# Altium project tyre_temps.PrjPcb
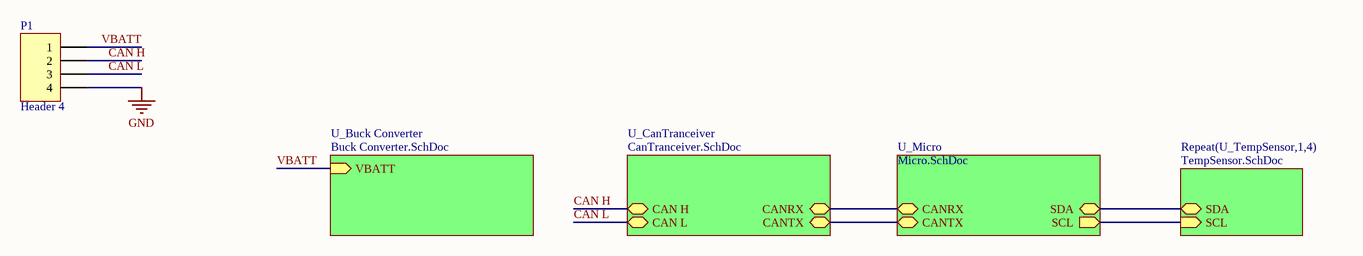
[diagram p0: Top Level.SchDoc]
5 sheets, 21 parts. Net scope: hierarchical (ports join the sheet entries above them; power ports are global).
Board file: tyre_temps.PcbDoc
Sheets:
  Top Level.SchDoc
    U_TempSensor1 = TempSensor.SchDoc
    U_TempSensor2 = TempSensor.SchDoc
    U_TempSensor3 = TempSensor.SchDoc
    U_TempSensor4 = TempSensor.SchDoc
    U_Buck Converter = Buck Converter.SchDoc
    U_CanTranceiver = CanTranceiver.SchDoc
    U_Micro = Micro.SchDoc

## Sheet Top Level.SchDoc
size A4

### Parts
P1  Header 4  [HDR1X4]

### Sub-sheets
Repeat(U_TempSensor,1,4) = TempSensor.SchDoc: SDA (bidir), SCL (in)
U_Buck Converter = Buck Converter.SchDoc: VBATT (in)
U_CanTranceiver = CanTranceiver.SchDoc: CANTX (bidir), CANRX (bidir), CAN H (bidir), CAN L (bidir)
U_Micro = Micro.SchDoc: SDA (bidir), SCL (out), CANRX (bidir), CANTX (bidir)

### Nets
GND: P1.4
CAN H: P1.2 ; sheet U_CanTranceiver/CAN H
CAN L: P1.3 ; sheet U_CanTranceiver/CAN L
SCL: sheet Repeat(U_TempSensor,1,4)/SCL, sheet U_Micro/SCL
SDA: sheet Repeat(U_TempSensor,1,4)/SDA, sheet U_Micro/SDA
VBATT: P1.1 ; sheet U_Buck Converter/VBATT
(unnamed): sheet U_CanTranceiver/CANTX, sheet U_Micro/CANTX
(unnamed): sheet U_CanTranceiver/CANRX, sheet U_Micro/CANRX

### Library data of the parts
P1 = Header 4: Header, 4-Pin; LatestRevisionDate: 17-Jul-2002; LatestRevisionNote: Re-released for DXP Platform.; Publisher: Altium Limited

## Sheet TempSensor.SchDoc
size A4
Used 4 times, as channels U_TempSensor1, U_TempSensor2, U_TempSensor3, U_TempSensor4. Parts and nets are listed once, with the designators drawn on the sheet.
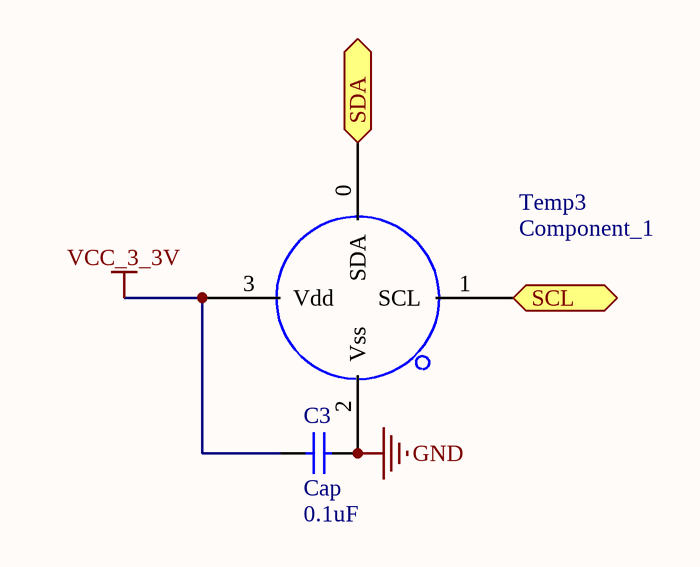
[diagram p1: TempSensor.SchDoc]

### Parts
C3  Cap  value 0.1uF  [R0805]
Temp3  Component_1  [MLX90614]

### Ports
SCL (in), SDA (bidir)

### Nets
GND: C3.2 Temp3.2(Vss)
VCC_3_3V: C3.1 Temp3.3(Vdd)
SCL: Temp3.1(SCL) ; port SCL
SDA: Temp3.0(SDA) ; port SDA

### Channels
U_TempSensor1: designators end in _U_TempSensor1; ports SCL=SCL SDA=SDA
U_TempSensor2: designators end in _U_TempSensor2; ports SCL=SCL SDA=SDA
U_TempSensor3: designators end in _U_TempSensor3; ports SCL=SCL SDA=SDA
U_TempSensor4: designators end in _U_TempSensor4; ports SCL=SCL SDA=SDA

### Library data of the parts
C3 = Cap: Capacitor; Published: 8-Jun-2000; LatestRevisionDate: 17-Jul-2002; LatestRevisionNote: Re-released for DXP Platform.; PackageReference: RAD-0.3; Publisher: Altium Limited; PackageDescription: Radial Cap, Thru-Hole; 2 Leads; 0.3 in Pin Spacing

## Sheet Buck Converter.SchDoc
size A4
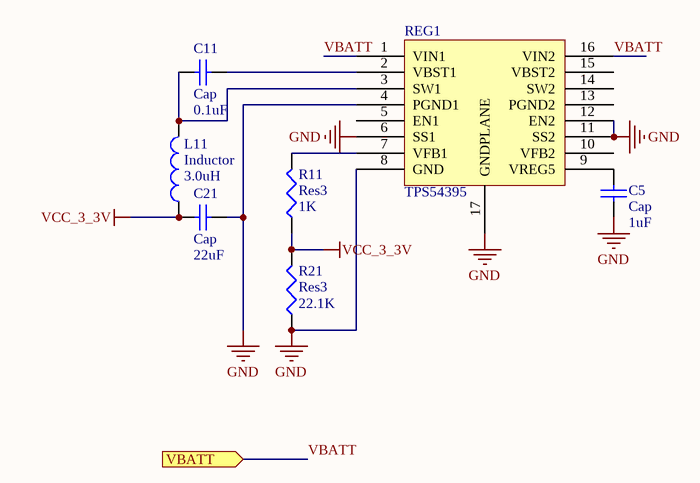
[diagram p2: Buck Converter.SchDoc]

### Parts
C5  Cap  value 1uF  [R0805]
C11  Cap  value 0.1uF  [R0805]
C21  Cap  value 22uF  [R0805]
L11  Inductor  value 3.0uH  [INDUCTOR]
R11  Res3  value 1K  [R0805]
R21  Res3  value 22.1K  [R0805]
REG1  TPS54395  [TPS54395]

### Ports
VBATT (in)

### Nets
GND: C5.2 C21.1 R21.1 REG1.4(PGND1) REG1.6(SS1) REG1.8(GND) REG1.11(SS2) REG1.12(EN2) REG1.17(GNDPLANE)
VCC_3_3V: C21.2 L11.1 R11.1 R21.2
VBATT: REG1.1(VIN1) REG1.16(VIN2) ; port VBATT
NetC5_1: C5.1 REG1.9(VREG5)
NetC11_1: C11.1 REG1.2(VBST1)
NetC11_2: C11.2 L11.2 REG1.3(SW1)
NetR11_2: R11.2 REG1.7(VFB1)

Not connected (* = marked no-connect by the designer): REG1 5(EN1) 10(VFB2) 13(PGND2) 14(SW2) 15(VBST2)

### Library data of the parts
C5 C11 C21 = Cap: Capacitor; Published: 8-Jun-2000; LatestRevisionDate: 17-Jul-2002; LatestRevisionNote: Re-released for DXP Platform.; PackageReference: RAD-0.3; Publisher: Altium Limited; PackageDescription: Radial Cap, Thru-Hole; 2 Leads; 0.3 in Pin Spacing
L11 = Inductor: Code_IEC: 1005; Published: 8-Jun-2000; LatestRevisionDate: 29-May-2009; LatestRevisionNote: IPC-7351 Footprint Added.; PackageReference: 0402-A; Publisher: Altium Limited; PackageDescription: Chip Inductor; Code_JEITA: 0402
R11 R21 = Res3: Resistor; Published: 8-Jun-2000; LatestRevisionDate: 29-May-2009; LatestRevisionNote: IPC-7351 Footprint Added.; PackageReference: J1-0603; Publisher: Altium Limited; PackageDescription: Chip Resistor
REG1 = TPS54395: Dual Channel Buck Converter

## Sheet CanTranceiver.SchDoc
size A4
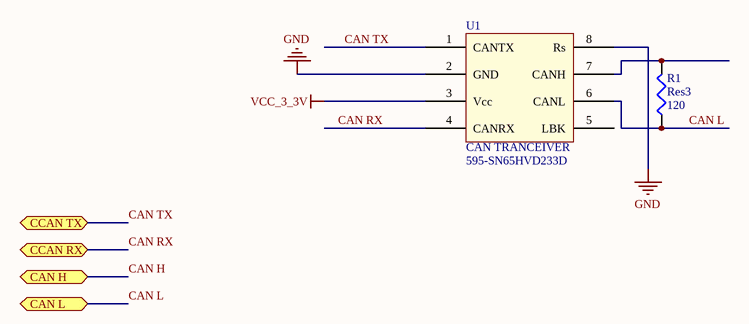
[diagram p3: CanTranceiver.SchDoc]

### Parts
R1  Res3  value 120  [R0805]
U1  CAN TRANCEIVER  Supplier Part Number 1: 595-SN65HVD233D  [SOP8]

### Ports
CAN H (bidir), CAN L (bidir), CCAN RX (bidir), CCAN TX (bidir)

### Nets
GND: U1.2(GND) U1.8(Rs)
VCC_3_3V: U1.3(Vcc)
CAN L: R1.1 U1.6(CANL) ; port CAN L
CAN RX: U1.4(CANRX) ; port CCAN RX
CAN TX: U1.1(CANTX) ; port CCAN TX
NetR1_2: R1.2 U1.7(CANH)

Not connected (* = marked no-connect by the designer): U1 5(LBK)

### Library data of the parts
R1 = Res3: Resistor; Published: 8-Jun-2000; LatestRevisionDate: 29-May-2009; LatestRevisionNote: IPC-7351 Footprint Added.; PackageReference: J1-0603; Publisher: Altium Limited; PackageDescription: Chip Resistor
U1 = 595-SN65HVD233: Supplier 1: Mouser

## Sheet Micro.SchDoc
size A4
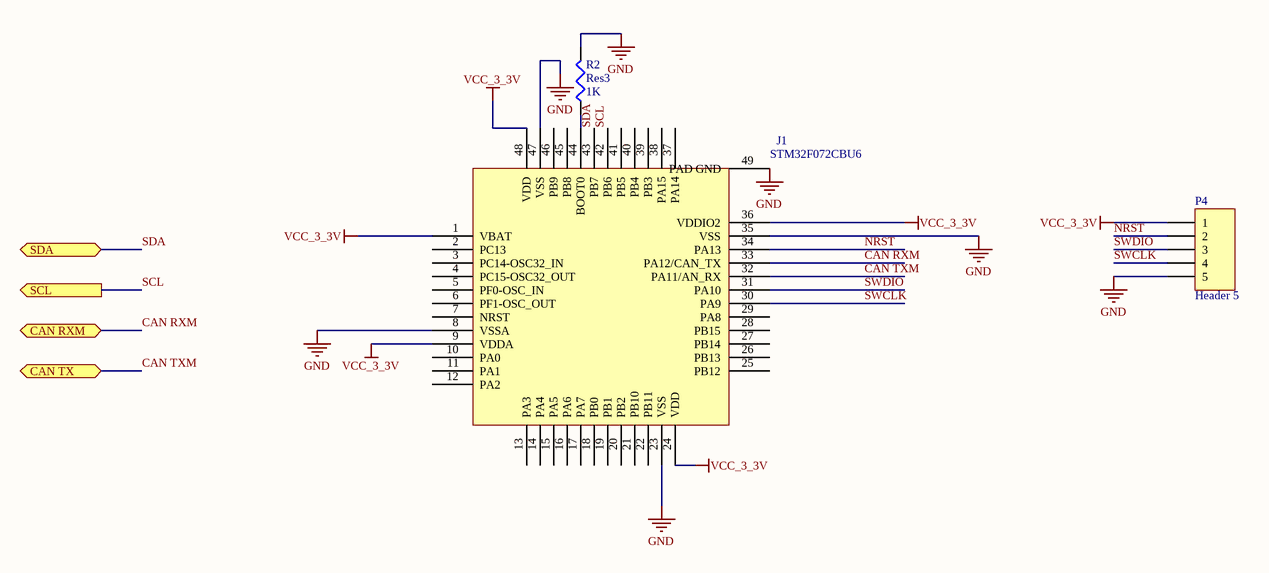
[diagram p4: Micro.SchDoc]

### Parts
J1  STM32F072CBU6  [STM32F072CBU6 - duplicate]
P4  Header 5  [HDR1X5]
R2  Res3  value 1K  [R0805]

### Ports
CAN RXM (bidir), CAN TX (bidir), SCL (out), SDA (bidir)

### Nets
GND: J1.8(VSSA) J1.23(VSS) J1.35(VSS) J1.47(VSS) J1.49(PAD_GND) P4.5 R2.2
VCC_3_3V: J1.1(VBAT) J1.9(VDDA) J1.24(VDD) J1.36(VDDIO2) J1.48(VDD) P4.1
CAN RXM: J1.33(PA12/CAN_TX) ; port CAN RXM
CAN TXM: J1.32(PA11/AN_RX) ; port CAN TX
NRST: J1.34(PA13) P4.2
SCL: J1.42(PB6) ; port SCL
SDA: J1.43(PB7) ; port SDA
SWCLK: J1.30(PA9) P4.4
SWDIO: J1.31(PA10) P4.3
NetJ1_44: J1.44(BOOT0) R2.1

Not connected (* = marked no-connect by the designer): J1 2(PC13) 3(PC14-OSC32_IN) 4(PC15-OSC32_OUT) 5(PF0-OSC_IN) 6(PF1-OSC_OUT) 7(NRST) 10(PA0) 11(PA1) 12(PA2) 13(PA3) 14(PA4) 15(PA5) 16(PA6) 17(PA7) 18(PB0) 19(PB1) 20(PB2) 21(PB10) 22(PB11) 25(PB12) 26(PB13) 27(PB14) 28(PB15) 29(PA8) 37(PA14) 38(PA15) 39(PB3) 40(PB4) 41(PB5) 45(PB8) 46(PB9)

### Library data of the parts
J1 = STM32F072CBU6: MICROCONTROLLER
P4 = Header 5: Header, 5-Pin; LatestRevisionDate: 17-Jul-2002; LatestRevisionNote: Re-released for DXP Platform.; Publisher: Altium Limited
R2 = Res3: Resistor; Published: 8-Jun-2000; LatestRevisionDate: 29-May-2009; LatestRevisionNote: IPC-7351 Footprint Added.; PackageReference: J1-0603; Publisher: Altium Limited; PackageDescription: Chip Resistor

## Nets that join several sheets
GND: Top Level (P1.4), U_TempSensor1 (C3_U_TempSensor1.2 Temp3_U_TempSensor1.2), U_TempSensor2 (C3_U_TempSensor2.2 Temp3_U_TempSensor2.2), U_TempSensor3 (C3_U_TempSensor3.2 Temp3_U_TempSensor3.2), U_TempSensor4 (C3_U_TempSensor4.2 Temp3_U_TempSensor4.2), Buck Converter (9 pins), CanTranceiver (U1.2 U1.8), Micro (7 pins)
VCC_3_3V: U_TempSensor1 (C3_U_TempSensor1.1 Temp3_U_TempSensor1.3), U_TempSensor2 (C3_U_TempSensor2.1 Temp3_U_TempSensor2.3), U_TempSensor3 (C3_U_TempSensor3.1 Temp3_U_TempSensor3.3), U_TempSensor4 (C3_U_TempSensor4.1 Temp3_U_TempSensor4.3), Buck Converter (C21.2 L11.1 R11.1 R21.2), CanTranceiver (U1.3), Micro (6 pins)
CAN L: Top Level (P1.3), CanTranceiver (R1.1 U1.6)
SCL: U_TempSensor1 (Temp3_U_TempSensor1.1), U_TempSensor2 (Temp3_U_TempSensor2.1), U_TempSensor3 (Temp3_U_TempSensor3.1), U_TempSensor4 (Temp3_U_TempSensor4.1), Micro (J1.42)
SDA: U_TempSensor1 (Temp3_U_TempSensor1.0), U_TempSensor2 (Temp3_U_TempSensor2.0), U_TempSensor3 (Temp3_U_TempSensor3.0), U_TempSensor4 (Temp3_U_TempSensor4.0), Micro (J1.43)
VBATT: Top Level (P1.1), Buck Converter (REG1.1 REG1.16)